# Altium schematic sheet buck_boost.SchDoc
size A3; SheetNumber: 5; SheetTotal: 7
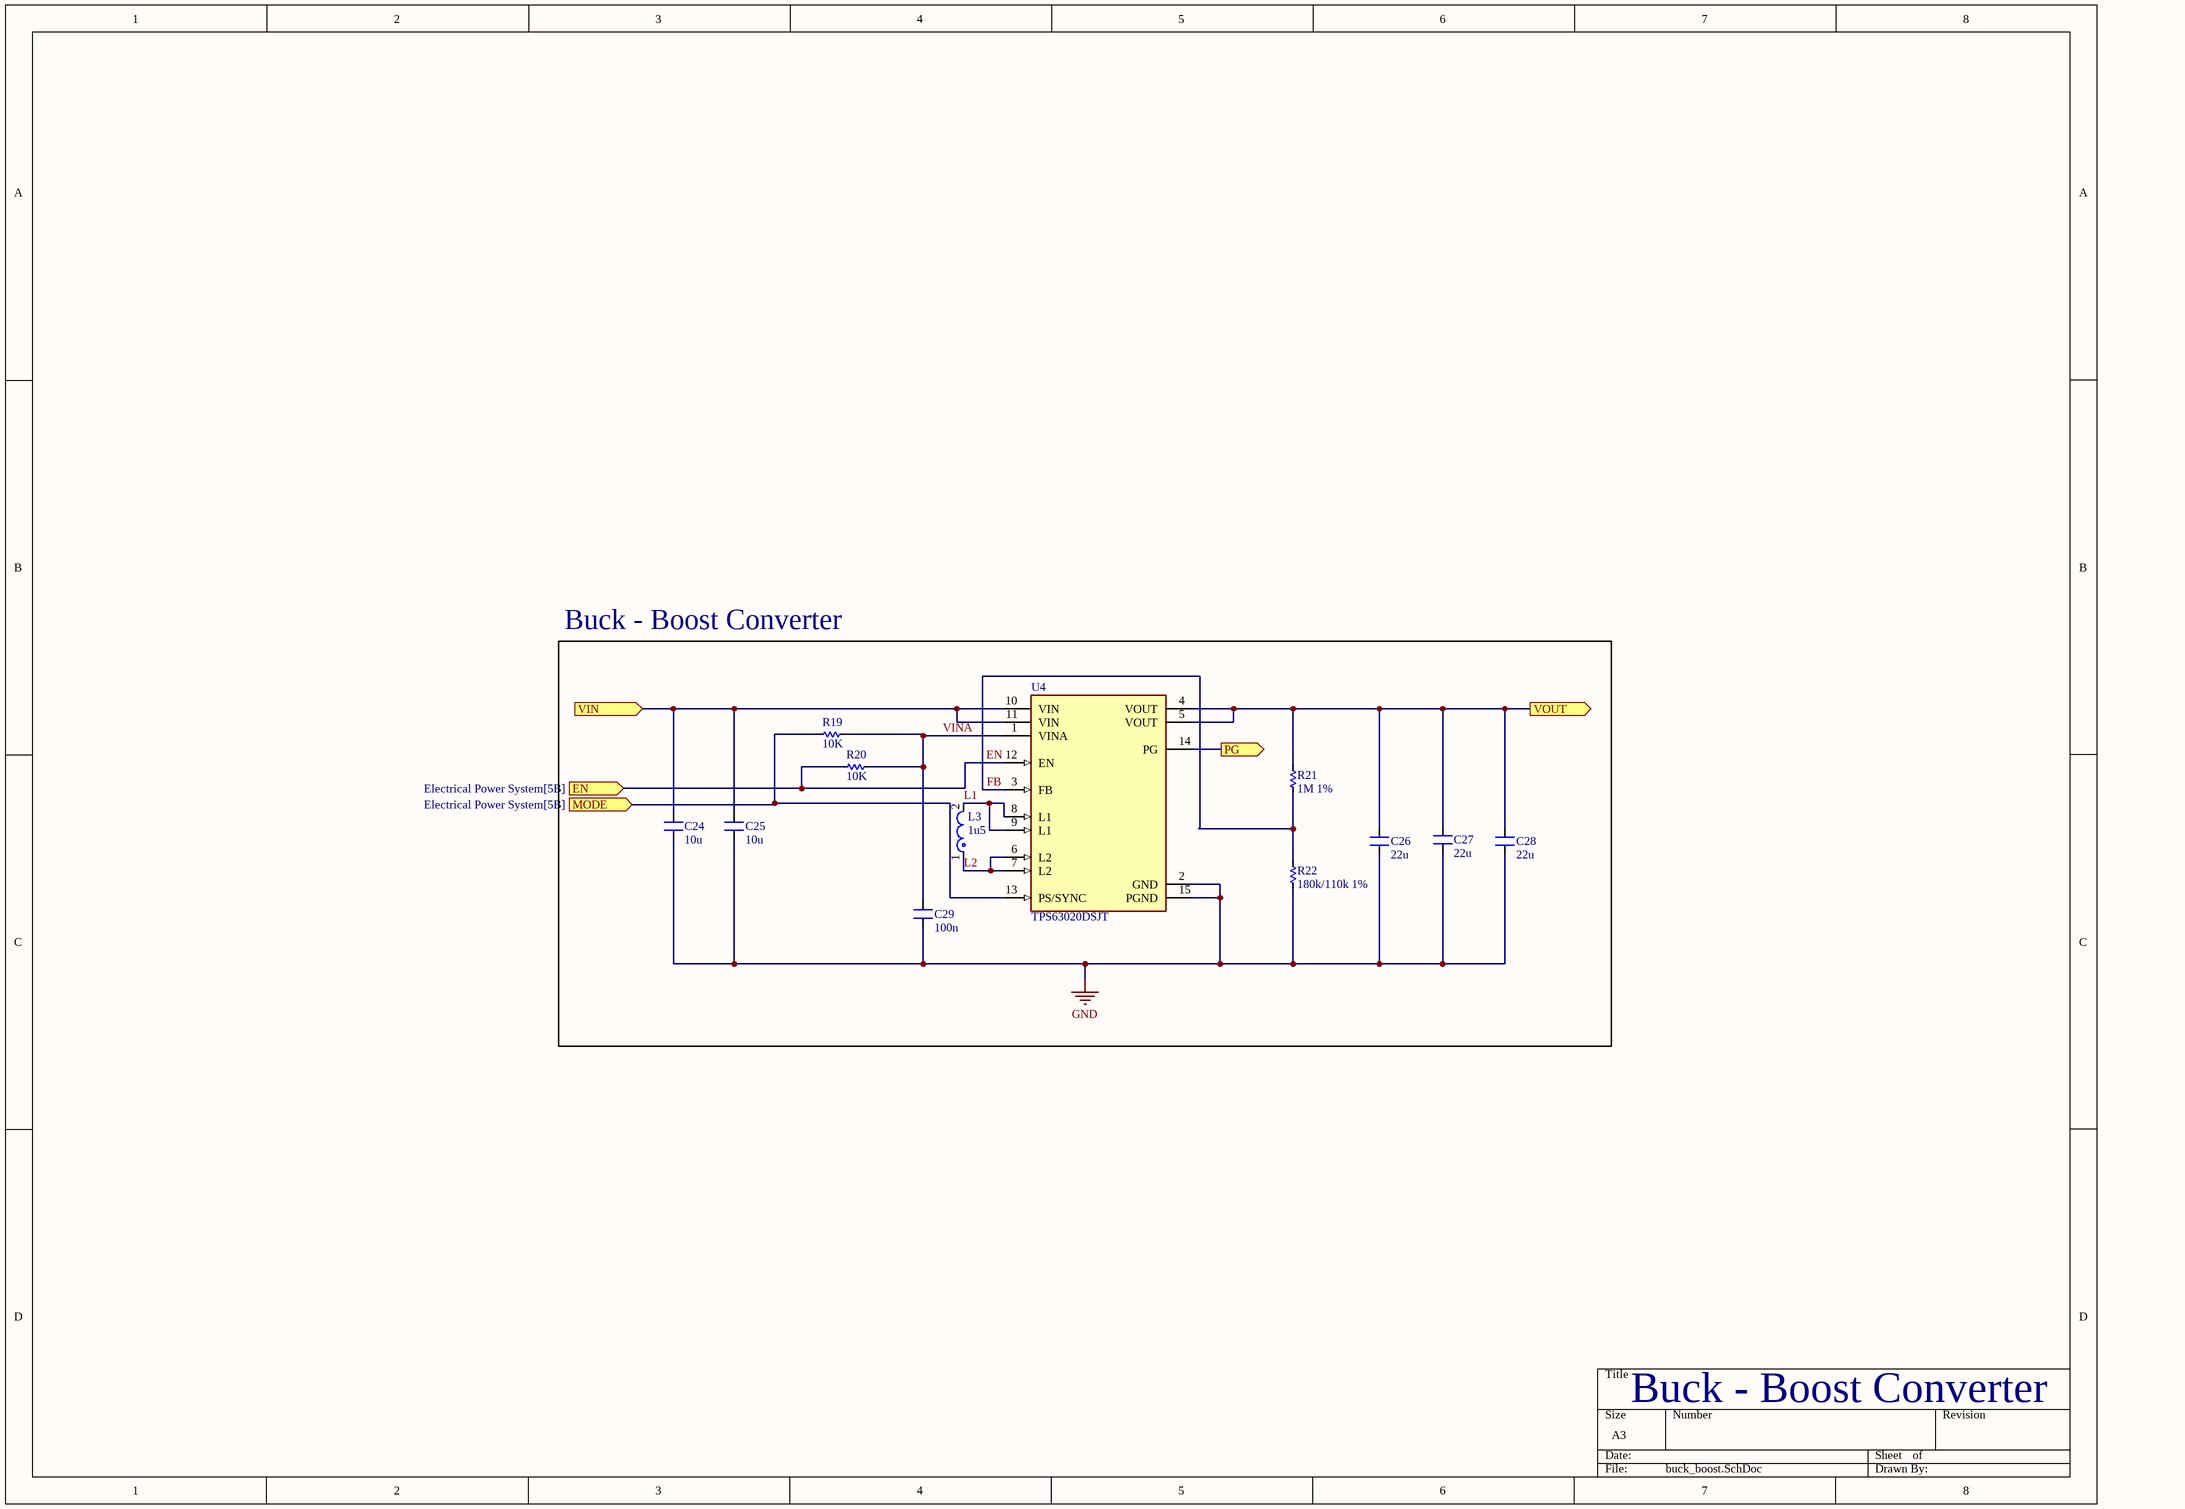
[diagram p0: buck_boost.SchDoc]

## Parts
C24  10u  [CN-SMD-0603]
C25  10u  [CN-SMD-0603]
C26  22u  [CN-SMD-0603]
C27  22u  [CN-SMD-0603]
C28  22u  [CN-SMD-0603]
C29  100n  [CN-SMD-0603]
L3  1u5  [FP-XFL4020-MFG]
R19  10K  [RES-SMD-0805]
R20  10K  [RES-SMD-0805]
R21  1M 1%  [RES-SMD-0805]
R22  180k/110k 1%  [RES-SMD-0805]
U4  TPS63020DSJT  [FP-DSJ0014A-MFG]

## Blocks framed on the sheet
Buck - Boost Converter: C24-C29 L3 R19-R22 U4

## Ports
EN (in, see Electrical Power System[5B]), MODE (in, see Electrical Power System[5B]), PG (out, see Electrical Power System[5B]), VIN (in, see Electrical Power System[5B]), VOUT (out, see Electrical Power System[6B])

## Nets
GND: C24.1 C25.1 C26.1 C27.1 C28.1 C29.1 R22.2 U4.2(GND) U4.15(PGND)
EN: R20.2 U4.12(EN) ; port EN
FB: R21.2 R22.1 U4.3(FB)
L1: L3.2 U4.8(L1) U4.9(L1)
L2: L3.1 U4.6(L2) U4.7(L2)
MODE: R19.2 U4.13(PS/SYNC) ; port MODE
PG: U4.14(PG) ; port PG
VIN: C24.2 C25.2 U4.10(VIN) U4.11(VIN) ; port VIN
VINA: C29.2 R19.1 R20.1 U4.1(VINA)
VOUT: C26.2 C27.2 C28.2 R21.1 U4.4(VOUT) U4.5(VOUT) ; port VOUT

## Notes on the sheet
- Buck - Boost Converter

## Library data of the parts
C24-C29 = Capacitors: Value: 33pF
L3 = CMP-11268-000104-1: Inductor Power Shielded Wirewound 1.5uH 20% 100KHz 9.1A 15.8mOhm DCR 1515 Automotive Embossed Plastic T/R; Core Material: Composite; DC Resistance (DCR): 15.8mR; Saturation Current: 4.1A; Self Resonant Frequency: 59MHz; Tolerance: 20%; Inductance: 1.5uH; Max DC Current: 9.1A; RoHS Compliant: Yes; Max Operating Temperature: 125°C; Length: 4.3mm; Case/Package: SMD/SMT; Mount: Surface Mount; Shielding: Shielded; Min Operating Temperature: -40°C; RMS Current (Irms): 9.1A; Test Frequency: 100kHz; Inductance Tolerance: 20%; REACH SVHC: No SVHC; Packaging: Tape and Reel; Termination: SMD/SMT; Lead Free: Contains Lead; Width: 4.3mm; Series: XFL4020; Height: 2.1mm
R19-R22 = Res SMD: SMD; Manufacturer: Generic Components; Class: Passive; Published: 08/06/2000; Publisher: Altium Hobart Technology Centre
U4 = CMP-2000-07282-2: IC REG BCK BST ADJ 3.5A 14VSON; Manufacturer: Texas Instruments; Switching Frequency: 2400kHz; Output Voltage: 1.2-5.5V; Nominal Supply Current: 25uA; Standoff Height: 0mm; Switching Topology: Buck-Boost; Min Supply Voltage: 1.8V; Output Type: AdjustableProgrammable; Max Junction Temp: +125°C; Number Of Outputs: 1; Output Current: 3A; Max Supply Voltage: 5.5V; ComponentLink2URL: https://www.ti.com/lit/ds/symlink/tps63020.pdf; Ambient Temperature Range High: +85°C; Digikey Description: IC REG BCK BST ADJ 3.5A 14VSON; Ambient Temperature Range Low: -40°C; Manufacturer Part Number: TPS63020DSJT; Automotive: No; Package: DSJ0014A; Category: IC; Temperature Range High: +85°C; Temperature: -40°C to +85°C; Octopart: https://octopart.com/tps63020dsjt-texas+instruments-12976119; Temperature Range Low: -40°C; Device Class L3: Voltage Regulators - Switching; Device Class L2: Power Management ICs; RoHS: TRUE; Lead Free: Yes; Height: 1mm; Device Class L1: Integrated Circuits (ICs); Mouser Description: Voltage Regulators - Switching Regulators 93% Eff Buck-Boost Converter; ComponentLink2Description: Datasheet